# EAGLE design main (EAGLE 8.5.2)
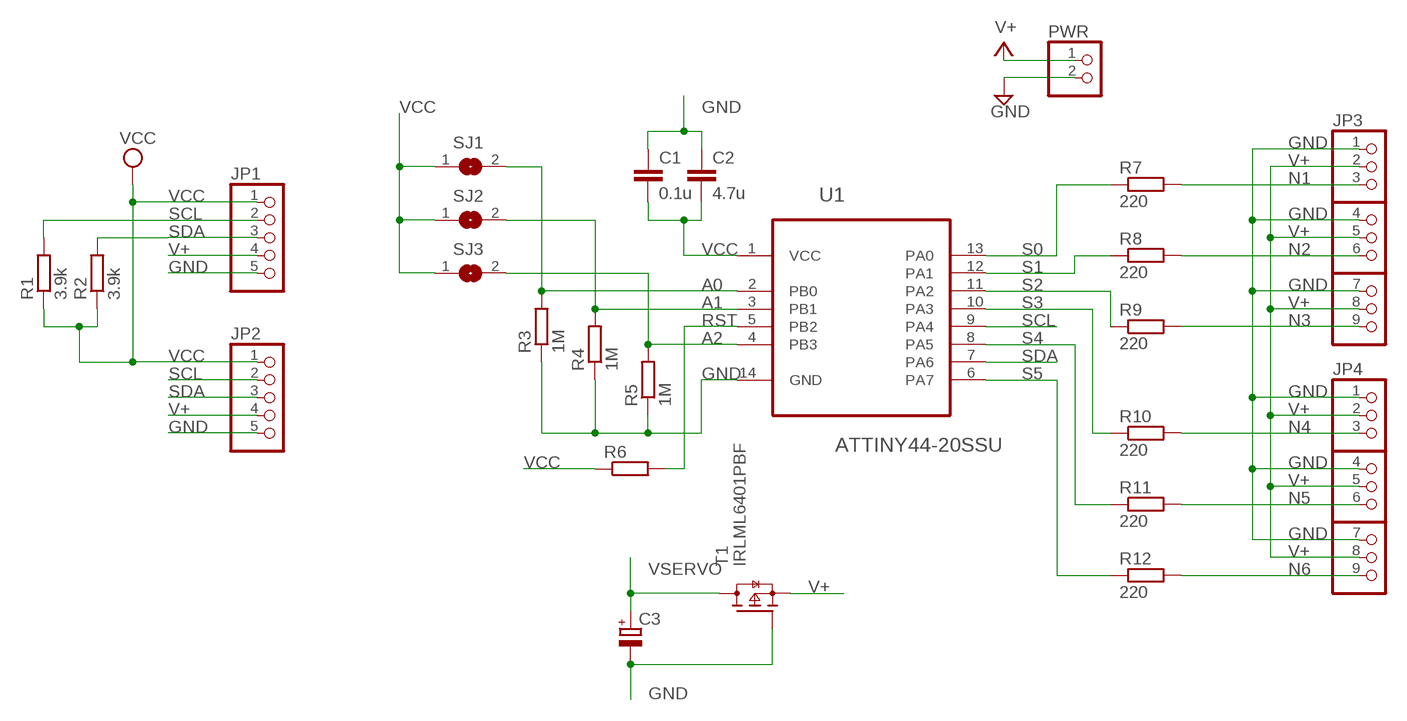
[diagram p0: schematic, sheet 1]

## Parts
C1  0.1u  C-EUC0805  [C0805]
C2  4.7u  C-EUC0805  [C0805]
C3  CPOL-EUE2.5-6  [E2,5-6]
JP1  PINHD-1X5  [1X05]
JP2  PINHD-1X5  [1X05]
JP3  PINHD-3X3  [3X03]
JP4  PINHD-3X3  [3X03]
PWR  PINHD-1X2  [1X02]
R1  3.9k  R-EU_R0805  [R0805]
R2  3.9k  R-EU_R0805  [R0805]
R3  1M  R-EU_R0805  [R0805]
R4  1M  R-EU_R0805  [R0805]
R5  1M  R-EU_R0805  [R0805]
R6  R-EU_R0805  [R0805]
R7  220  R-EU_R0805  [R0805]
R8  220  R-EU_R0805  [R0805]
R9  220  R-EU_R0805  [R0805]
R10  220  R-EU_R0805  [R0805]
R11  220  R-EU_R0805  [R0805]
R12  220  R-EU_R0805  [R0805]
SJ1  SJ  [SJ]
SJ2  SJ  [SJ]
SJ3  SJ  [SJ]
T1  IRLML6401PBF  [SOT23]
U1  ATTINY44-20SSU  [SOIC127P600X175-14N]

## Nets
A0: R3.2 SJ1.2 U1.2(PB0)
A1: R4.2 SJ2.2 U1.3(PB1)
A2: R5.2 SJ3.2 U1.4(PB3)
GND [gnd]: C1.1 C2.1 C3.- JP1.5 JP2.5 JP3.1 JP3.4 JP3.7 JP4.1 JP4.4 JP4.7 PWR.2 R3.1 R4.1 R5.1 T1.1(G) U1.14(GND)
N1: JP3.3 R7.2
N2: JP3.6 R8.2
N3: JP3.9 R9.2
N4: JP4.3 R10.2
N5: JP4.6 R11.2
N6: JP4.9 R12.2
RST: R6.2 U1.5(PB2)
S0: R7.1 U1.13(PA0)
S1: R8.1 U1.12(PA1)
S2: R9.1 U1.11(PA2)
S3: R10.1 U1.10(PA3)
S4: R11.1 U1.8(PA5)
S5: R12.1 U1.6(PA7)
SCL: JP1.2 JP2.2 R1.2 U1.9(PA4)
SDA: JP1.3 JP2.3 R2.2 U1.7(PA6)
V+ [pwr]: JP1.4 JP2.4 JP3.2 JP3.5 JP3.8 JP4.2 JP4.5 JP4.8 PWR.1 T1.2(S)
VCC: C1.2 C2.2 JP1.1 JP2.1 R1.1 R2.1 R6.1 SJ1.1 SJ2.1 SJ3.1 U1.1(VCC)
VSERVO: C3.+ T1.3(D)

## Library data of the parts
C1 C2 = rcl:C-EU: CAPACITOR, European symbol; SPICEPREFIX: C
C3 = rcl:CPOL-EU: POLARIZED CAPACITOR, European symbol; SPICEPREFIX: C
JP1 JP2 = pinhead:PINHD-1X5: PIN HEADER
JP3 JP4 = servo-ctrl-6x:PINHD-3X3: PIN HEADER
PWR = pinhead:PINHD-1X2: PIN HEADER
R1-R12 = rcl:R-EU_: RESISTOR, European symbol; SPICEPREFIX: R
SJ1-SJ3 = jumper:SJ: SMD solder JUMPER
T1 = servo-ctrl-6x:IRLML6401PBF: P-channel enhancement mode vertical DMOS transistor P-channel enhancement mode vertical Diffusion Metal-Oxide Semiconductor (DMOS) transistor in a small Surface-Mounted Device (SMD) plastic package. AAL Eindhoven MK
U1 = atmel:ATTINY44-20SSU: 8-bit Microcontroller with Bytes In-System Programmable Flash; MPN: ATTINY44-20SSU; OC_FARNELL: 1455152; OC_NEWARK: 58M3787; PACKAGE: SOIC-14; SUPPLIER: Atmel

## Net classes
0 default: width 0.203 mm, clearance 0.178 mm
1 pwr: width 0.406 mm, clearance 0.203 mm to class 0, clearance 0.356 mm
2 gnd: width 0.406 mm, clearance 0.203 mm to class 0, clearance 0.356 mm to class 1, clearance 0.356 mm

## Board
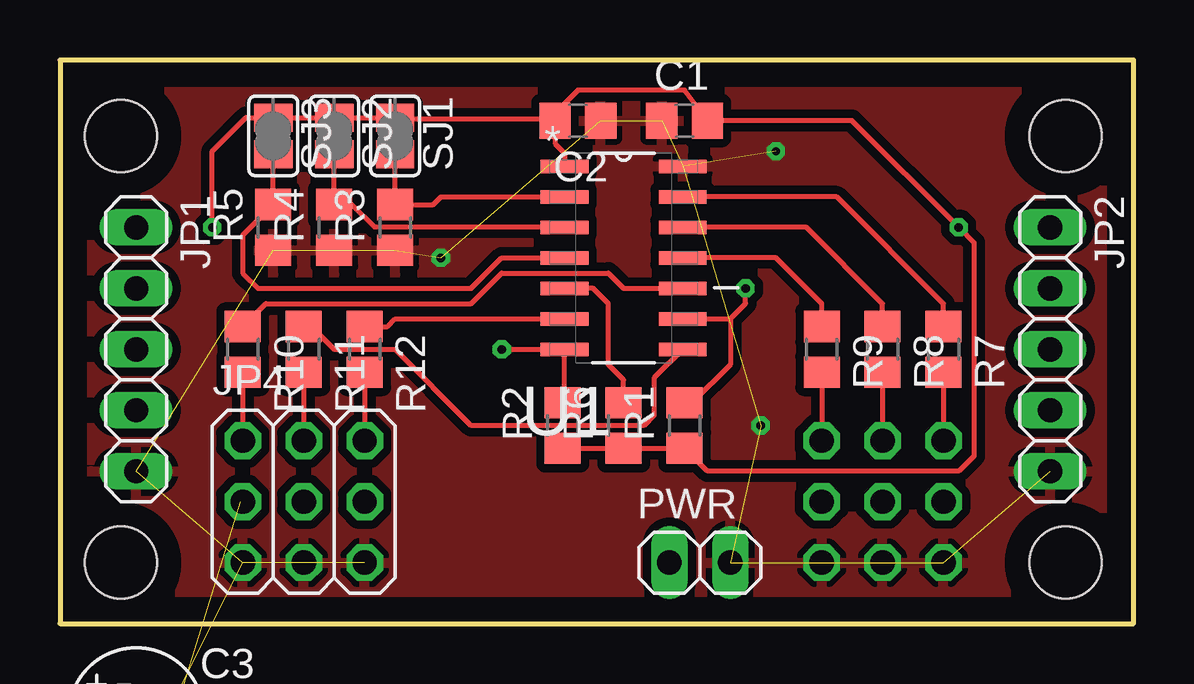
[diagram p1: board, top side]
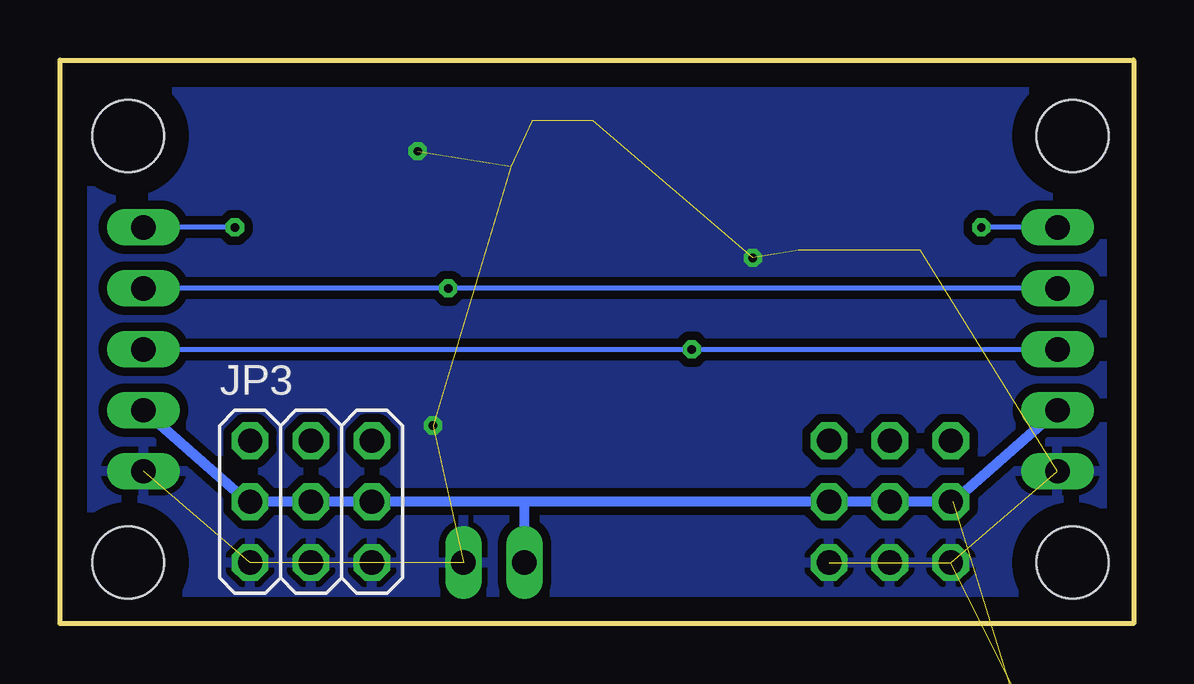
[diagram p2: board, bottom side, seen from below]

Size 44.76 x 23.48 mm. Coordinates in mm from the lower left corner, seen from the top.
Outline: 0,0 44.76,0 44.76,23.48 0,23.48 0,0
Copper layers (1*16): Top 0.035mm / dielectric 1.5mm / Bottom 0.035mm
Design rules "default": minimum track width 6mil, minimum drill 0.35mm, track to track 6mil, track to pad 6mil, pad to pad 6mil, via to via 6mil, smd to smd 6mil, copper to edge 40mil, drill to drill 6mil, minimum pad ring 10mil, minimum via ring 8mil, stop-mask expansion 4mil, vias tented up to drill 0mil, thermal gap 10mil
Holes 3 mm at 2.54,2.54 41.91,2.54 2.54,20.32 41.91,20.32

### Footprints (pad centres in the part's own frame; a part is rotated, then mirrored left to right if it is on the bottom)
C0805 = smd 1.3 x 1.5: 1 -0.95,0; 2 0.95,0
E2,5-6 = drill 0.813 pad 1.6: + -1.27,0 | drill 0.813 pad 1.6 octagon: - 1.27,0
1X05 = drill 1.016 long: 1 -5.08,0; 2 -2.54,0; 3 0,0; 4 2.54,0; 5 5.08,0
3X03 = drill 1.016 octagon: 1 -2.54,-3.81; 2 -2.54,-1.27; 3 -2.54,1.27; 4 0,-3.81; 5 0,-1.27; 6 0,1.27; 7 2.54,-3.81; 8 2.54,-1.27; 9 2.54,1.27
1X02 = drill 1.016 long: 1 -1.27,0; 2 1.27,0
R0805 = smd 1.3 x 1.5: 1 -0.95,0; 2 0.95,0
SJ = smd 1.168 x 1.6: 1 -0.762,0; 2 0.762,0
SOT23 = smd 1 x 1.4: 1 -0.95,-1.1; 2 0.95,-1.1; 3 0,1.1
SOIC127P600X175-14N = smd 1.981 x 0.559: 1 -2.464,3.81; 2 -2.464,2.54; 3 -2.464,1.27; 4 -2.464,0; 5 -2.464,-1.27; 6 -2.464,-2.54; 7 -2.464,-3.81; 8 2.464,-3.81; 9 2.464,-2.54; 10 2.464,-1.27; 11 2.464,0; 12 2.464,1.27; 13 2.464,2.54; 14 2.464,3.81

### Placement (x,y rotation side)
C1  26.04,20.95 0 top
C2  21.59,20.95 180 top
C3  3.17,-3.81 0 top  (outside the outline)
JP1  3.17,11.43 270 top
JP2  41.27,11.43 270 top
JP3  34.29,6.35 0 bottom
JP4  10.16,6.35 0 top
PWR  26.67,2.54 0 top
R1  26.04,8.26 90 top
R2  20.95,8.26 90 top
R3  13.97,16.51 90 top
R4  11.43,16.51 90 top
R5  8.89,16.51 90 top
R6  23.5,8.26 90 top
R7  36.83,11.43 270 top
R8  34.29,11.43 270 top
R9  31.75,11.43 270 top
R10  7.62,11.43 270 top
R11  10.16,11.43 270 top
R12  12.7,11.43 270 top
SJ1  13.97,20.32 270 top
SJ2  11.43,20.32 270 top
SJ3  8.89,20.32 270 top
T1  1.91,-8.89 0 top  (outside the outline)
U1  23.5,15.24 0 top

### Tracks (layer width: path | path; a pad name or v marks a point on that pad's centre or on a via)
A0
  Top 0.203: SJ1.2 R3.2 15.55,17.46 15.88,17.78 U1.2
A1
  Top 0.203: SJ2.2 R4.2 12.18,17.46 13.1,16.53 21.01,16.53 U1.3
A2
  Top 0.203: SJ3.2 R5.2 7.62,16.19 7.62,14.61 8.26,13.97 17.14,13.97 18.41,15.24 U1.4
GND  (via drill 0.35)  (19 unrouted)
  other vias: 15.88,15.24 29.84,19.68 29.21,8.26
  pour Top: 0.64,22.86 43.81,22.86 43.81,0.64 0.64,0.64
  pour Bottom: 0.64,22.86 43.81,22.86 43.81,0.64 0.64,0.64
N1
  Top 0.203: R7.2 JP3.3
N2
  Top 0.203: R8.2 JP3.6
N3
  Top 0.203: R9.2 JP3.9
N4
  Top 0.203: R10.2 JP4.3
N5
  Top 0.203: R11.2 JP4.6
N6
  Top 0.203: R12.2 JP4.9
RST
  Top 0.203: R6.2 23.5,10.16 22.86,10.79 22.86,13.34 22.23,13.97 U1.5
S0
  Top 0.203: R7.1 36.83,13.34 32.38,17.78 U1.13
S1
  Top 0.203: R8.1 34.29,13.34 31.11,16.51 U1.12
S2
  Top 0.203: R9.1 31.75,13.34 29.84,15.24 U1.11
S3
  Top 0.203: R10.1 8.57,13.34 17.14,13.34 18.41,14.61 22.86,14.61 23.5,13.97 U1.10
S4
  Top 0.203: R11.1 10.48,12.38 11.43,11.43 13.97,11.43 17.14,8.26 24.34,8.26 24.77,8.68 24.77,10.24 U1.8
S5
  Top 0.203: R12.1 13.65,12.38 13.97,12.7 U1.6
SCL  (via drill 0.35)
  Top 0.203: U1.9 27.94,12.7 | 27.94,12.7 28.57,13.34 v28.57,13.97 | 27.94,12.7 27.94,10.79 26.35,9.21 R1.2
  Bottom 0.203: JP1.2 v28.57,13.97 JP2.2
SDA  (via drill 0.35)
  Top 0.203: R2.2 21.03,9.28 U1.7 v18.41,11.43
  Bottom 0.203: JP2.3 v18.41,11.43 JP1.3
V+  (1 unrouted)
  Bottom 0.406: JP1.4 7.53,5.08 JP4.2 JP4.5 JP4.8 25.4,5.08 | 25.4,5.08 JP3.8 JP3.5 JP3.2 36.92,5.08 JP2.4 | PWR.1 25.4,5.08
VCC  (via drill 0.35)
  Top 0.203: R2.1 R6.1 R1.1 26.99,6.35 37.47,6.35 38.1,6.99 38.1,15.88 v37.47,16.51 33.02,20.95 C1.2 26.04,22.23 21.59,22.23 20.64,21.27 C2.2 | 14.03,21.02 SJ1.1 SJ2.1 SJ3.1 7.75,21.08 6.35,19.68 v6.35,16.51 | 14.03,21.02 14.1,20.95 | C2.2 20.64,20 21.03,19.61 U1.1 | C2.2 20.58,21.02 14.03,21.02
  Bottom 0.203: JP1.1 v6.35,16.51 | v37.47,16.51 JP2.1
VSERVO  (1 unrouted)